# Altium schematic sheet Power Block Diagram.SchDoc
size A
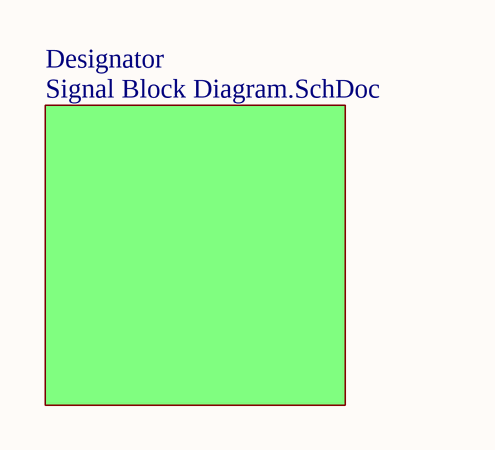
[diagram p0: Power Block Diagram.SchDoc]

## Sub-sheets
Designator = Signal Block Diagram.SchDoc: no entries